# EAGLE design thermo (EAGLE 9.6.0)
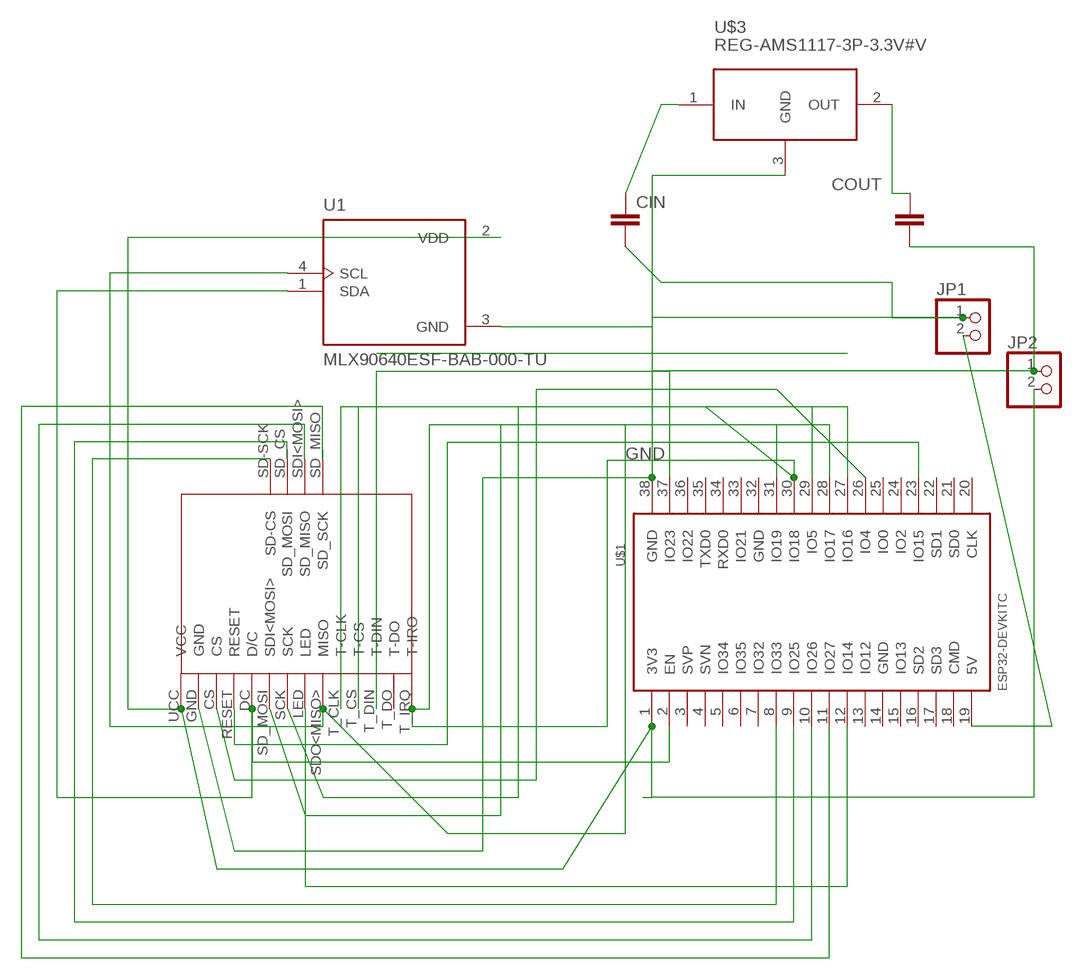
[diagram p0: schematic, sheet 1]

## Parts
CIN  C2.5/2  [C2.5-2]
COUT  C2.5/2  [C2.5-2]
JP1  PINHD-1X2  [1X02]
JP2  PINHD-1X2  [1X02]
U1  MLX90640ESF-BAB-000-TU  [TO292P945H1165-4]
U$1  ESP32DEVKITC  [ESP32-DEVKITC]
U$2  TFT.SPI.240X320  [SKR1]
U$3  REG-AMS1117-3P-3.3V#V  [REG-AMS1117-3P#V]

## Nets
GND: CIN.2 COUT.2 JP1.1 JP2.1 U1.3(GND) U$1.38(GND) U$2.GND U$3.3(GND)
N$1: JP1.2 U$1.19(5V)
N$3: JP2.2 U1.2(VDD) U$1.1(3V3) U$2.UCC(VCC)
N$4: U1.4(SCL) U$1.31(IO19) U$2.SDO<MISO>(MISO)
N$5: U$2.SD_MOSI(SDI<MOSI>)
N$6: U$1.37(IO23) U$2.T_DIN(T-DIN)
N$7: U$1.26(IO4) U$2.CS
N$8: U1.1(SDA) U$1.2(EN) U$2.DC(D/C)
N$9: U$1.23(IO15) U$2.RESET
N$10: U$1.12(IO14) U$2.LED
N$11: U$1.8(IO33) U$2.SD-SCK(SD-CS)
N$12: U$1.28(IO17) U$1.30(IO18) U$2.SCK U$2.T_IRQ(T-IRO)
N$13: CIN.1 U$3.1(IN)
N$14: U$1.9(IO25) U$2.SD_CS(SD_MOSI)
N$15: COUT.1 U$3.2(OUT)
N$16: U$1.10(IO26) U$2.SDI<MOSI>(SD_MISO)
N$17: U$1.11(IO27) U$2.SD_MISO(SD_SCK)
N$19: U$1.27(IO16) U$1.29(IO5) U$2.T_CLK(T-CLK) U$2.T_CS(T-CS)
Unconnected: U$1.3(SVP) U$1.4(SVN) U$1.5(IO34) U$1.6(IO35) U$1.7(IO32) U$1.13(IO12) U$1.14(GND) U$1.15(IO13) U$1.16(SD2) U$1.17(SD3) U$1.18(CMD) U$1.20(CLK) U$1.21(SD0) U$1.22(SD1) U$1.24(IO2) U$1.25(IO0) U$1.32(GND) U$1.33(IO21) U$1.34(RXD0) U$1.35(TXD0) U$1.36(IO22) U$2.T_DO(T-DO)

## Library data of the parts
CIN COUT = capacitor-wima:C: CAPACITOR naming: grid - package width
JP1 JP2 = pinhead:PINHD-1X2: PIN HEADER
U1 = teploblinEkran:MLX90640ESF-BAB-000-TU: SENSOR DGTL -40C-85C TO39; AVAILABILITY: Unavailable; DESCRIPTION: Thermal Image Sensor 32H x 24V TO-39; MF: Melexis Technologies NV; MP: MLX90640ESF-BAB-000-TU; PACKAGE: TO-39 Melexis Technologies NV; PRICE: None
U$1 = teploblinEkran:ESP32DEVKITC
U$2 = teploblinEkran:TFT.SPI.240X320
U$3 = teploblinEkran:REG-AMS1117-3P-*: Linear Regulator based on AMS1117 chip 3-pin version AMS1117 datasheet is available here: http://www.advanced-monolithic.com/pdf/ds1117.pdf Click here to find device on ebay.com <http://www.ebay.com/sch/ams1117+module> Note: There are many variants. Search for the proper version.

## Board
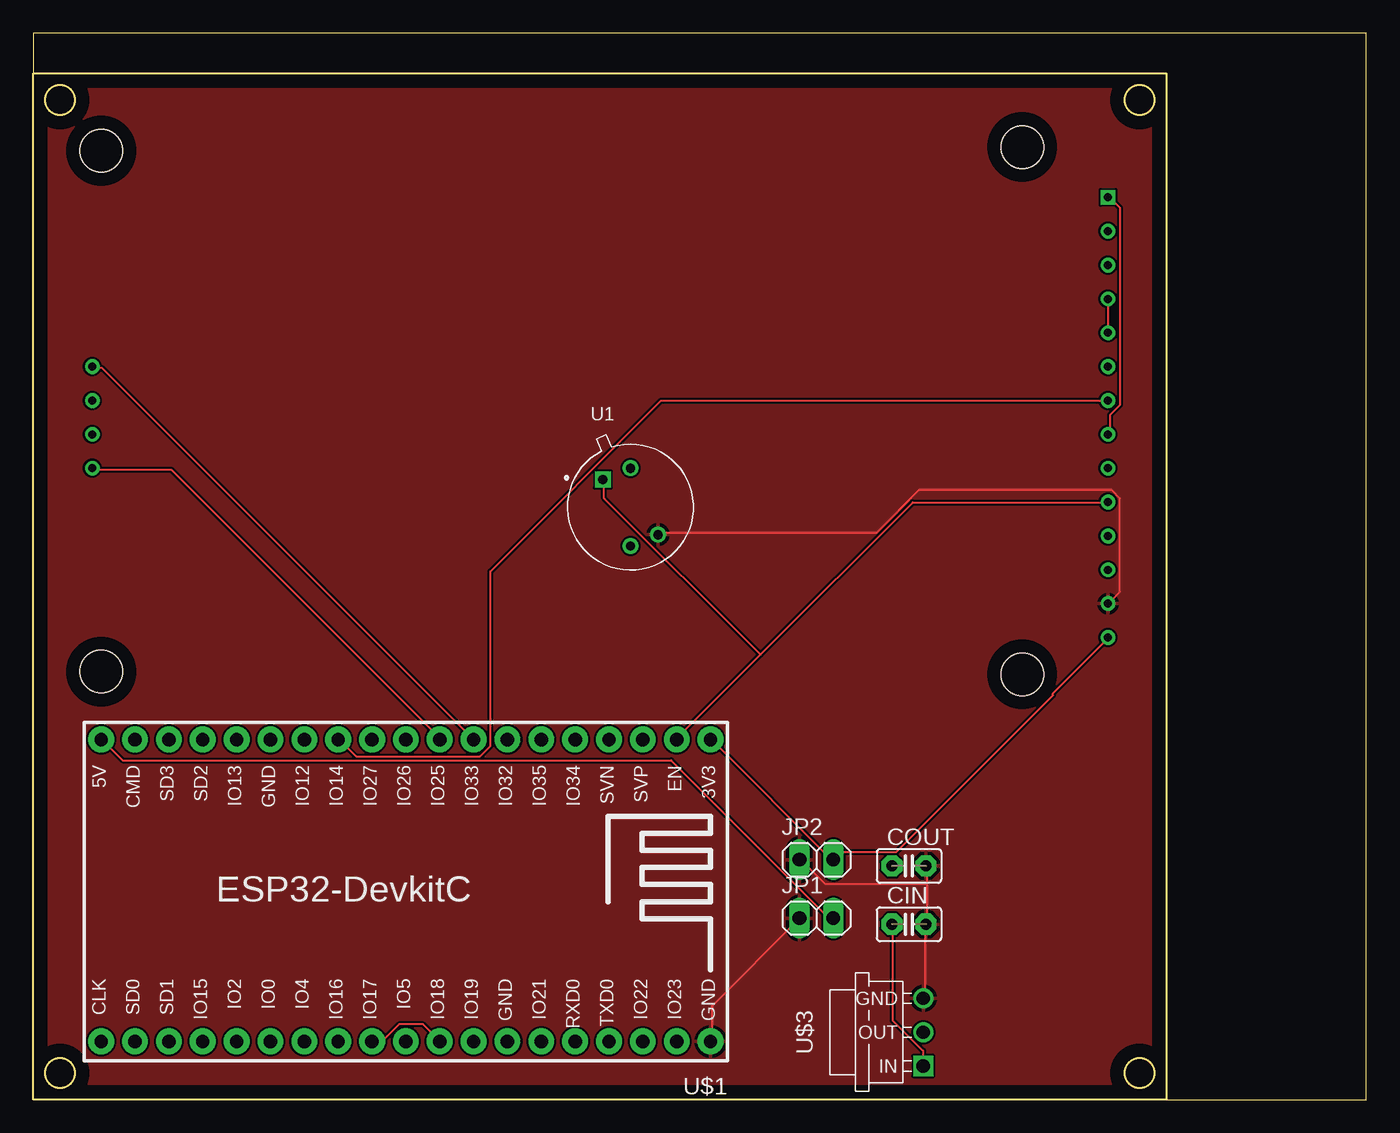
[diagram p1: board, top side]
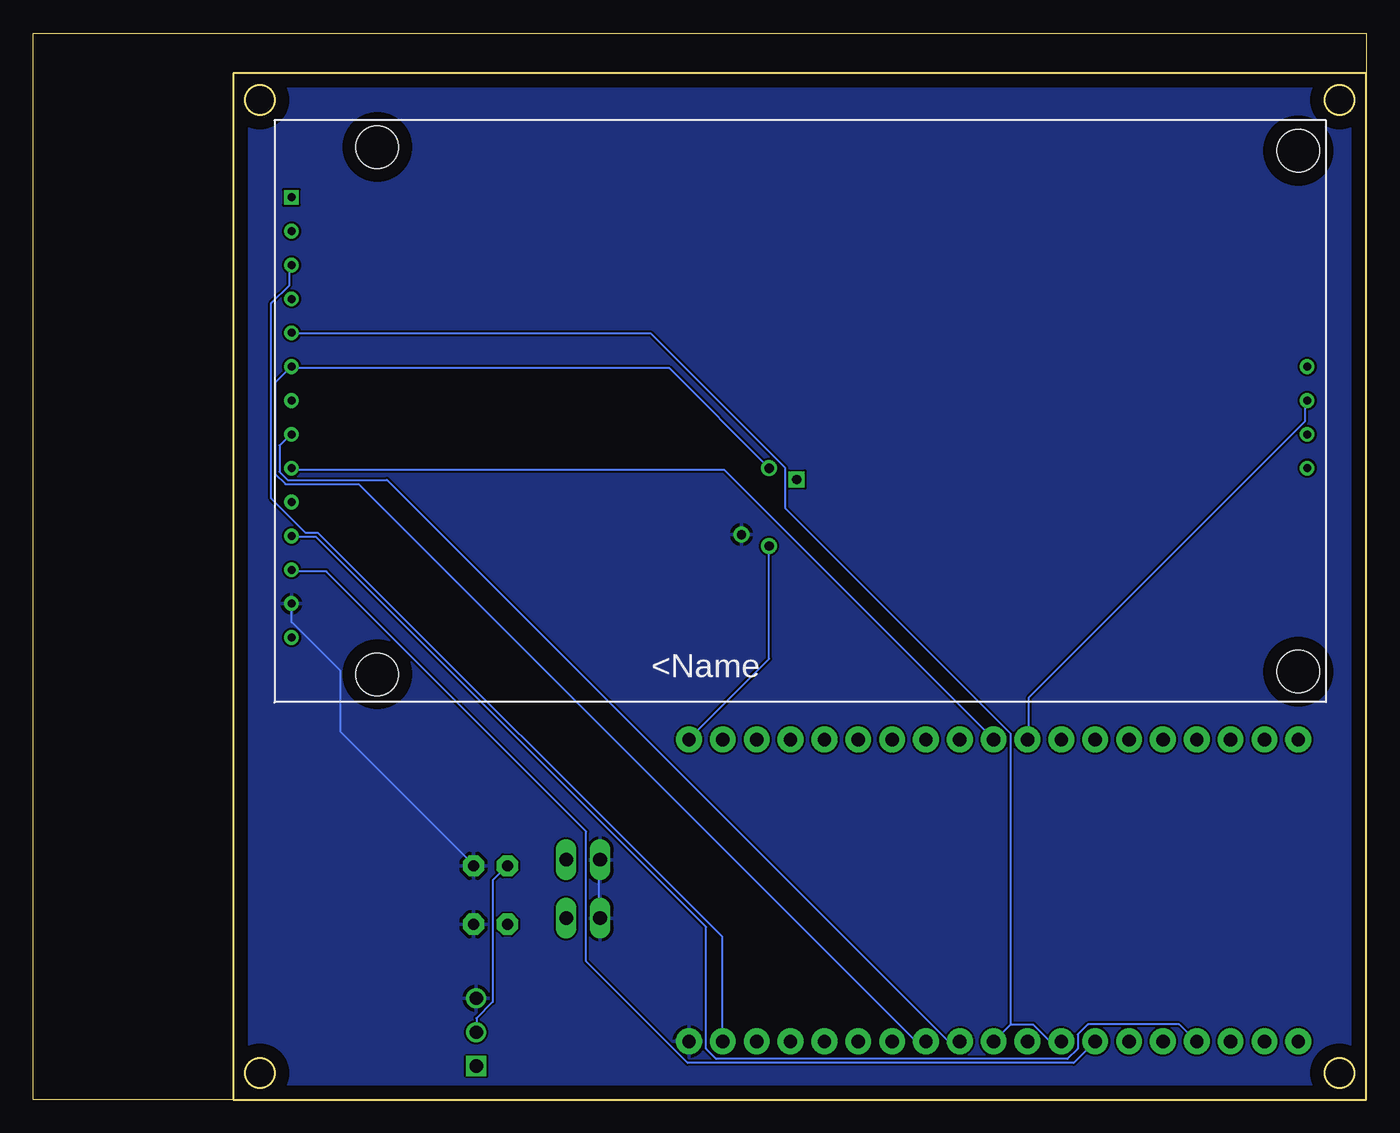
[diagram p2: board, bottom side, seen from below]

Size 100 x 80 mm. Coordinates in mm from the lower left corner, seen from the top.
Outline: 85,0 100,0 100,80 0,80 0,77
Outline: 0,77 0,0 85,0
Outline: 0,77 85,77 85,0
Outline: circle at 2,2 radius 1.1
Outline: circle at 83,2 radius 1.1
Outline: circle at 83,75 radius 1.1
Outline: circle at 2,75 radius 1.1
Copper layers (1*16): Top 0.035mm / dielectric 1.5mm / Bottom 0.035mm
Design rules "default": minimum track width 6mil, minimum drill 0.35mm, track to track 6mil, track to pad 6mil, pad to pad 6mil, via to via 6mil, smd to smd 6mil, copper to edge 40mil, drill to drill 6mil, minimum pad ring 10mil, minimum via ring 8mil, stop-mask expansion 4mil, vias tented up to drill 0mil, thermal gap 10mil

### Footprints (pad centres in the part's own frame; a part is rotated, then mirrored left to right if it is on the bottom)
C2.5-2 = drill 0.813 pad 1.6 octagon: 1 -1.27,0; 2 1.27,0
1X02 = drill 1.016 long: 1 -1.27,0; 2 1.27,0
TO292P945H1165-4 = drill 0.7 pad 1.1 square: 1 -2.065,2.067 | drill 0.7 pad 1.1: 2 0,-2.92; 3 2.065,-2.065; 4 0,2.92
ESP32-DEVKITC = drill 1 pad 1.93: 1 -22.87,-11.42; 2 -20.33,-11.42; 3 -17.79,-11.42; 4 -15.25,-11.42; 5 -12.71,-11.42; 6 -10.17,-11.42; 7 -7.63,-11.42; 8 -5.09,-11.42; 9 -2.55,-11.42; 10 -0.01,-11.42; 11 2.53,-11.42; 12 5.07,-11.42; 13 7.61,-11.42; 14 10.15,-11.42; 15 12.69,-11.42; 16 15.23,-11.42; 17 17.77,-11.42; 18 20.31,-11.42; 19 22.85,-11.42; 20 22.85,11.23; 21 20.31,11.23; 22 17.77,11.23; 23 15.23,11.23; 24 12.69,11.23; 25 10.15,11.23; 26 7.61,11.23; 27 5.07,11.23; 28 2.53,11.23; 29 -0.01,11.23; 30 -2.55,11.23; 31 -5.09,11.23; 32 -7.63,11.23; 33 -10.17,11.23; 34 -12.71,11.23; 35 -15.25,11.23; 36 -17.79,11.23; 37 -20.33,11.23; 38 -22.87,11.23
SKR1 = drill 0.6: CS -5.08,0; DC -10.16,0; GND -2.54,0; LED -17.78,0; RESET -7.62,0; SCK -15.24,0; SD-SCK -20.32,76.2; SD_CS -12.7,76.2; SD_MISO -17.78,76.2; SD_MOSI -15.24,76.2; SDI<MOSI> -12.7,0; SDO<MISO> -20.32,0; T_CLK -22.86,0; T_CS -25.4,0; T_DIN -27.94,0; T_DO -30.48,0; UCC 0,0 | drill 0.6 square: T_IRQ -33.02,0 | hole 3.2: -36.525,75.54; 2.565,75.54; 2.76,6.44; -36.8,6.44
REG-AMS1117-3P#V = drill 1 square: 1 -2.54,-5.08 | drill 1: 2 0,-5.08; 3 2.54,-5.08

### Placement (x,y rotation side)
CIN  65.7,13.15 0 top
COUT  65.7,17.53 0 top
JP1  58.75,13.61 0 top
JP2  58.75,17.99 0 top
U1  44.8,44.45 0 top
U$1  27.94,15.59 180 top
U$2  80.63,34.67 270 bottom
U$3  61.69,5.05 90 top

### Tracks (layer width: path | path; a pad name or v marks a point on that pad's centre or on a via)
GND
  Top 0.152: U$1.38 50.9,4.42 50.9,7.01 57.45,13.56 JP1.1 | U$3.3 66.9,7.62 66.9,13.11 CIN.2 67.06,13.26 67.06,16.15 | U1.3 46.94,42.52 63.25,42.52 66.45,45.72 80.92,45.72 81.53,45.11 81.53,38.1 80.77,37.34 U$2.GND | 67.06,16.15 67.06,17.53 COUT.2 | 67.06,16.15 59.44,16.15 57.61,17.98 JP2.1
  Bottom 0.152: JP1.1 57.61,13.72 57.61,17.98 JP2.1 | U$2.GND 80.62,37.19 80.62,35.81 76.96,32.16 76.96,27.58 67.06,17.68 COUT.2
  pour Bottom: 0,0 87,0 87,78 0,78
  pour Top: -1,-1 88,-1 88,79 -1,79
N$1
  Top 0.152: JP1.2 59.89,13.72 59.59,13.72 47.85,25.45 6.71,25.45 5.18,26.98 U$1.19
N$3
  Top 0.152: U$2.UCC 80.62,34.59 76.5,30.48 76.5,30.33 64.77,18.59 60.5,18.59 60.05,18.14 JP2.2 59.89,17.98 50.9,26.98 U$1.1
  Bottom 0.152: U1.2 44.81,41.45 44.81,33.07 50.75,27.13 U$1.1
N$4
  Bottom 0.152: U1.4 44.81,47.4 52.27,54.86 80.62,54.86 U$2.SDO<MISO> 80.77,54.86 81.84,53.8 81.84,46.94 81.08,46.18 75.59,46.18 33.83,4.42 33.07,4.42 U$1.31
N$6
  Bottom 0.152: U$2.T_DIN 80.77,62.48 80.77,61.11 82.14,59.74 82.14,45.11 79.55,42.52 78.64,42.52 48.31,12.19 48.31,4.42 U$1.37
N$7
  Bottom 0.152: U$2.CS 80.62,39.62 78.03,39.62 58.52,20.12 58.52,10.36 50.9,2.74 21.95,2.74 20.42,4.27 U$1.26
N$8
  Top 0.152: 54.56,33.38 48.31,27.13 U$1.2 | 54.56,33.38 65.99,44.81 80.62,44.81 U$2.DC | 54.56,33.38 42.82,45.11 42.82,46.48 U1.1
N$9
  Bottom 0.152: U$2.RESET 80.62,42.22 78.79,42.22 49.53,12.95 49.53,3.81 48.77,3.05 22.4,3.05 21.64,3.81 21.64,4.88 20.88,5.64 14.02,5.64 12.8,4.42 U$1.23
N$10
  Top 0.152: U$2.LED 80.62,52.43 47.09,52.43 34.29,39.62 34.29,26.52 33.53,25.76 24.23,25.76 23.01,26.98 U$1.12
N$11
  Top 0.152: U$2.SD-SCK 4.57,54.86 5.18,54.86 32.92,27.13 U$1.8
N$12
  Top 0.152: U$1.28 25.45,4.42 26.21,4.42 27.43,5.64 29.26,5.64 30.48,4.42 U$1.30 | U$2.SCK 80.77,49.99 80.77,51.36 81.53,52.12 81.53,66.9 80.77,67.67 U$2.T_IRQ
  Bottom 0.152: U$1.30 30.63,4.42 31.39,4.42 73.46,46.48 80.92,46.48 81.53,47.09 81.53,49.07 80.77,49.84 U$2.SCK
N$13
  Top 0.152: U$3.1 66.75,2.59 66.75,3.66 64.47,5.94 64.47,13.11 CIN.1
N$14
  Top 0.152: U$2.SD_CS 4.57,47.24 10.36,47.24 30.48,27.13 U$1.9
N$15
  Bottom 0.152: U$3.2 66.75,5.18 66.75,6.1 65.53,7.32 65.53,16.46 64.47,17.53 COUT.1
N$16
  Bottom 0.152: U$2.SDI<MOSI> 80.62,47.24 48.16,47.24 28.04,27.13 U$1.10
N$17
  Bottom 0.152: U$2.SD_MISO 4.57,52.43 4.57,50.9 25.3,30.18 25.3,27.13 U$1.11
N$19
  Top 0.152: U$2.T_CLK 80.62,57.61 80.62,60.05 U$2.T_CS
  Bottom 0.152: 26.67,5.64 26.67,27.43 43.59,44.35 43.59,47.4 53.65,57.45 80.62,57.45 U$2.T_CLK | 26.67,5.64 27.89,4.42 U$1.29 | 26.67,5.64 24.99,5.64 23.77,4.42 23.01,4.42 U$1.27